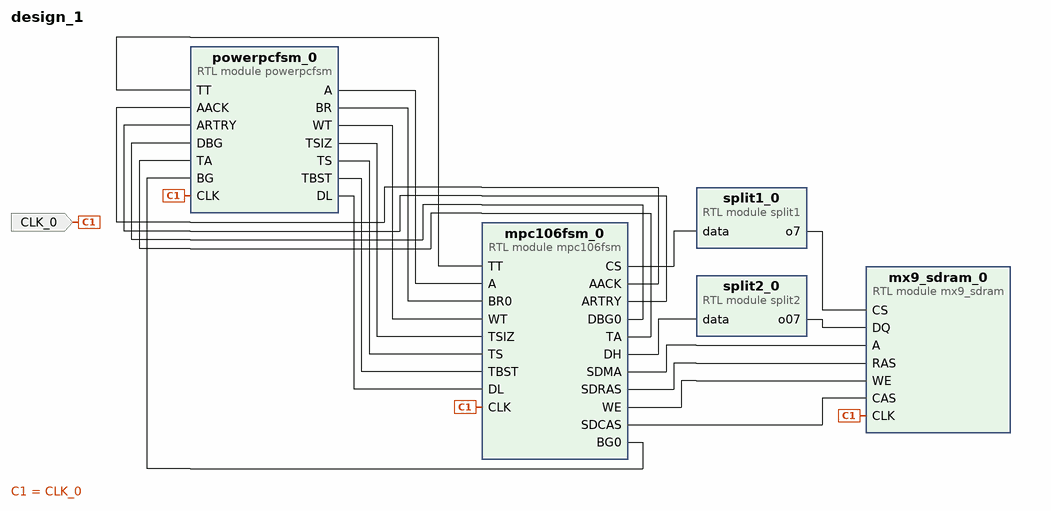
[diagram p0: block diagram of the top level]
# Vivado block design design_1, xc7a100tcsg324-1, Vivado 2020.1.1
create_bd_design design_1

create_bd_port -dir I -type clk CLK_0

create_bd_cell -type module -reference powerpcfsm powerpcfsm_0
create_bd_cell -type module -reference mx9_sdram mx9_sdram_0
create_bd_cell -type module -reference split1 split1_0
create_bd_cell -type module -reference mpc106fsm mpc106fsm_0
create_bd_cell -type module -reference split2 split2_0

# ---- connections ----

connect_bd_net [get_bd_pins mpc106fsm_0/AACK] [get_bd_pins powerpcfsm_0/AACK]
connect_bd_net [get_bd_pins mpc106fsm_0/ARTRY] [get_bd_pins powerpcfsm_0/ARTRY]
connect_bd_net [get_bd_pins powerpcfsm_0/A] [get_bd_pins mpc106fsm_0/A]
connect_bd_net [get_bd_pins powerpcfsm_0/BR] [get_bd_pins mpc106fsm_0/BR0]
connect_bd_net -net CLK_0_1 [get_bd_ports CLK_0] [get_bd_pins powerpcfsm_0/CLK] [get_bd_pins mx9_sdram_0/CLK] [get_bd_pins mpc106fsm_0/CLK]
connect_bd_net [get_bd_pins mpc106fsm_0/DBG0] [get_bd_pins powerpcfsm_0/DBG]
connect_bd_net [get_bd_pins mpc106fsm_0/TA] [get_bd_pins powerpcfsm_0/TA]
connect_bd_net [get_bd_pins powerpcfsm_0/WT] [get_bd_pins mpc106fsm_0/WT]
connect_bd_net [get_bd_pins powerpcfsm_0/TSIZ] [get_bd_pins mpc106fsm_0/TSIZ]
connect_bd_net [get_bd_pins powerpcfsm_0/TS] [get_bd_pins mpc106fsm_0/TS]
connect_bd_net [get_bd_pins powerpcfsm_0/TBST] [get_bd_pins mpc106fsm_0/TBST]
connect_bd_net [get_bd_pins powerpcfsm_0/DL] [get_bd_pins mpc106fsm_0/DL]
connect_bd_net [get_bd_pins mpc106fsm_0/BG0] [get_bd_pins powerpcfsm_0/BG]
connect_bd_net [get_bd_pins mpc106fsm_0/CS] [get_bd_pins split1_0/data]
connect_bd_net [get_bd_pins mpc106fsm_0/SDMA] [get_bd_pins mx9_sdram_0/A]
connect_bd_net [get_bd_pins split1_0/o7] [get_bd_pins mx9_sdram_0/CS]
connect_bd_net [get_bd_pins mpc106fsm_0/SDRAS] [get_bd_pins mx9_sdram_0/RAS]
connect_bd_net [get_bd_pins mpc106fsm_0/WE] [get_bd_pins mx9_sdram_0/WE]
connect_bd_net [get_bd_pins mpc106fsm_0/SDCAS] [get_bd_pins mx9_sdram_0/CAS]
connect_bd_net [get_bd_pins split2_0/o07] [get_bd_pins mx9_sdram_0/DQ]
connect_bd_net [get_bd_pins powerpcfsm_0/TT] [get_bd_pins mpc106fsm_0/TT]
connect_bd_net [get_bd_pins mpc106fsm_0/DH] [get_bd_pins split2_0/data]

validate_bd_design
save_bd_design
